# EAGLE design ac_switch (EAGLE 6.5.0)
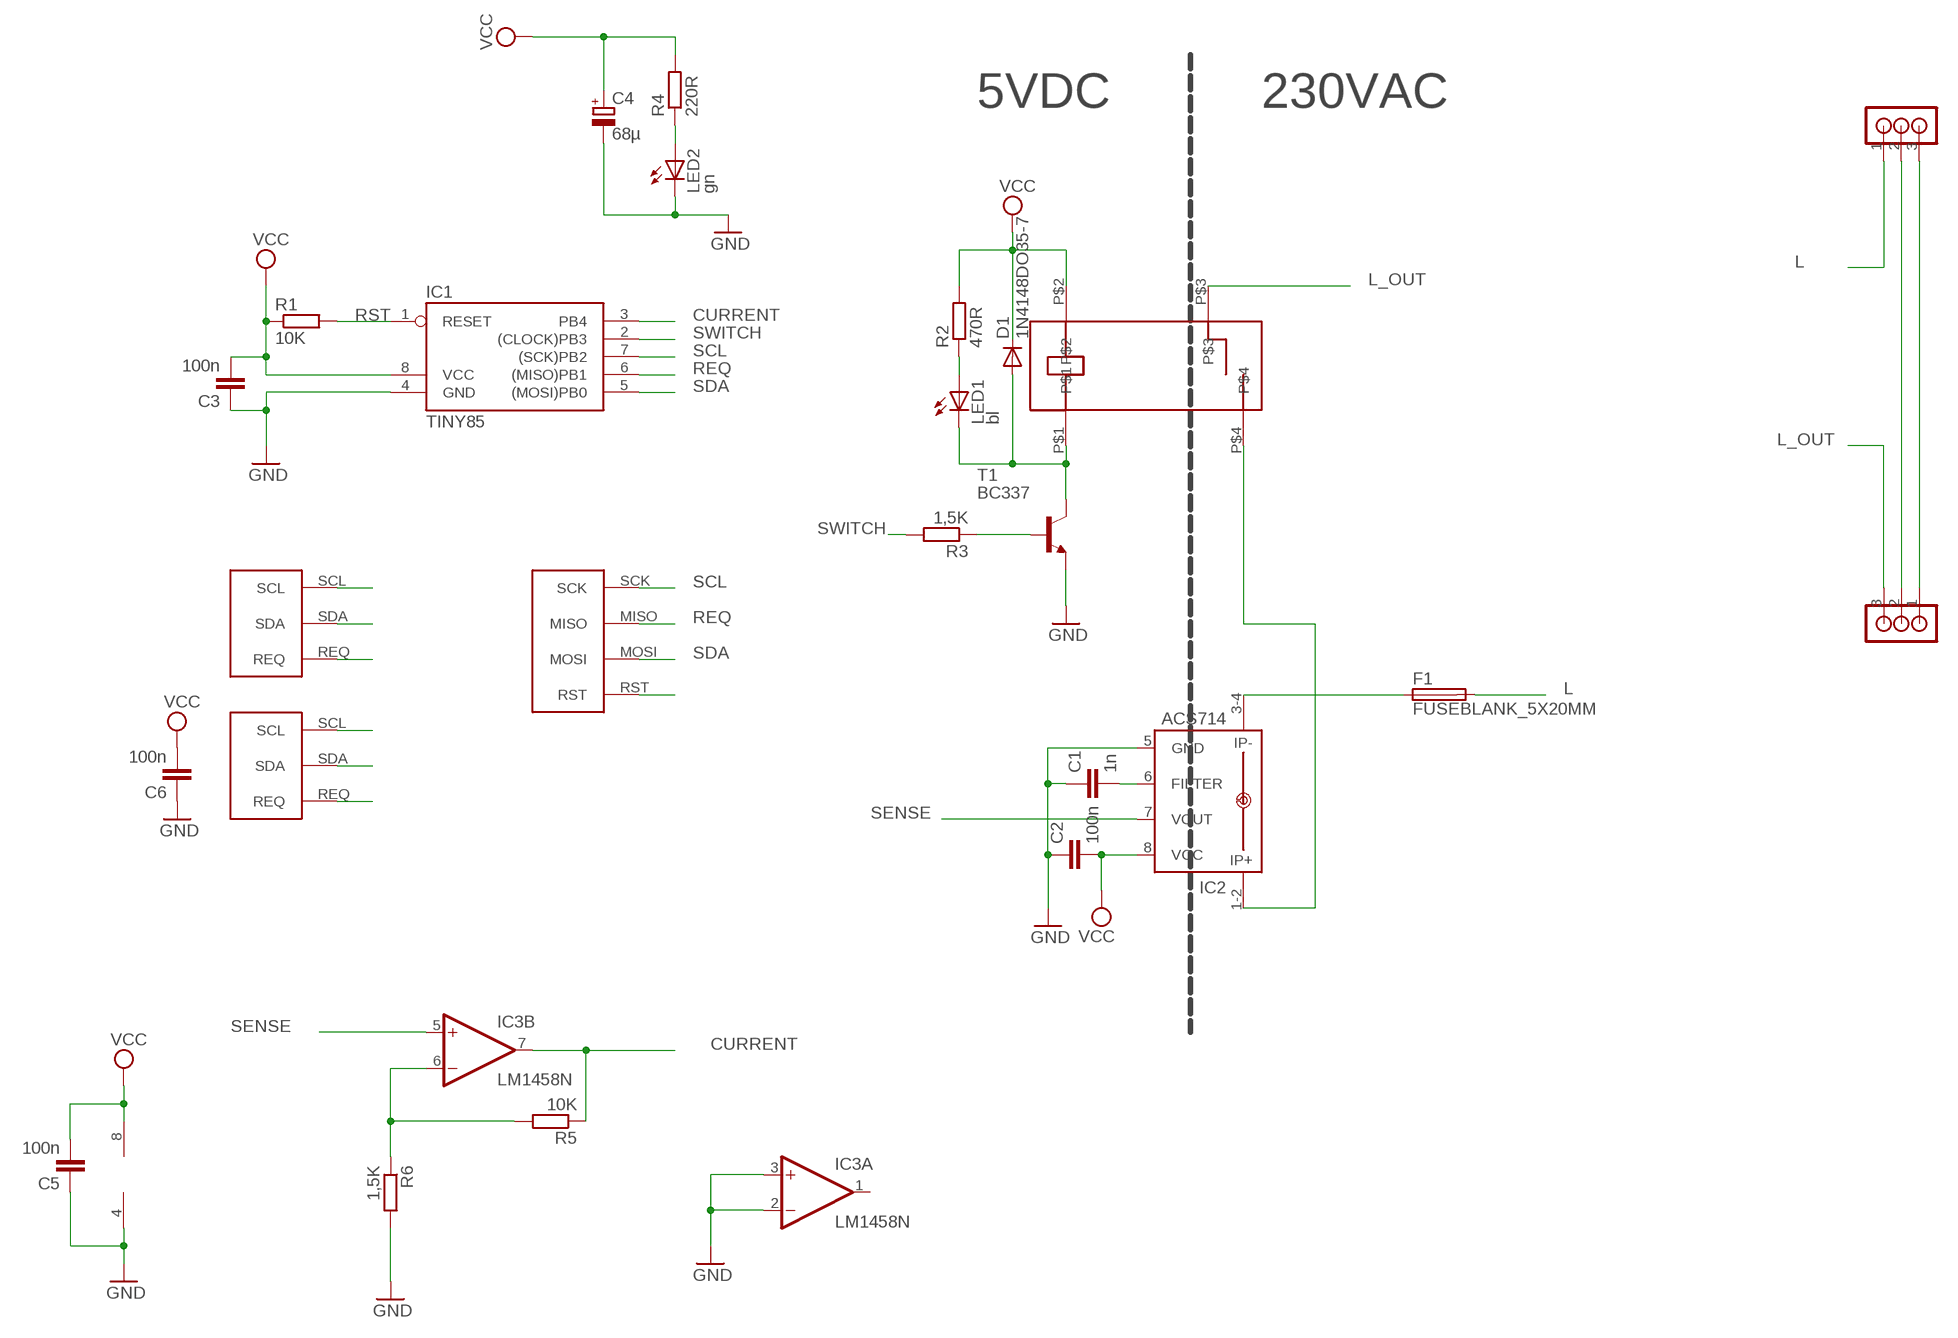
[diagram p0: schematic, sheet 1]

## Parts
C1  1n  C-EU025-024X044  [C025-024X044]
C2  100n  C-EU025-024X044  [C025-024X044]
C3  100n  C-EU025-024X044  [C025-024X044]
C4  68µ  CPOL-EUE3.5-8  [E3,5-8]
C5  100n  C-EU025-024X044  [C025-024X044]
C6  100n  C-EU025-024X044  [C025-024X044]
D1  1N4148DO35-7  [DO35-7]
F1  FUSEBLANK_5X20MM  [FUSE_HOLDER_5X20MM]
IC1  TINY85  TINY22P  [DIL08]
IC2  ACS714  [ACS714]
IC3  LM1458N  [DIL08]
LED1  bl  LED3MM  [LED3MM]
LED2  gn  LED3MM  [LED3MM]
R1  10K  R-EU_0207/12  [0207/12]
R2  470R  R-EU_0207/10  [0207/10]
R3  1,5K  R-EU_0207/10  [0207/10]
R4  220R  R-EU_0207/10  [0207/10]
R5  10K  R-EU_0207/10  [0207/10]
R6  1,5K  R-EU_0207/10  [0207/10]
T1  BC337  [TO92]
U$1  JS_05_MN_KT  [JS_05_MN_KT]
U$2  RIACON_101_3  [RIACON_101_3]
U$3  I3C_PORT  [I3C_PADS]
U$4  AVR_ISP  [AVR_ISP]
U$5  I3C_PORT  [I3C_PADS]
U$6  RIACON_101_3  [RIACON_101_3]

## Nets
CURRENT: IC1.3(PB4) IC3.7(B:OUT) R5.1
GND: C1.1 C2.1 C3.1 C4.- C5.1 C6.1 IC1.4(GND) IC2.5(GND) IC3.2(A:-IN) IC3.3(A:+IN) IC3.4(P:V-) LED2.K(C) R6.2 T1.1(E)
L: F1.2 U$2.1
L_OUT: U$1.P$3 U$6.3
N$1: D1.A LED1.K(C) T1.3(C) U$1.P$1
N$2: C1.2 IC2.6(FILTER)
N$3: IC2.1-2(IP+) U$1.P$4
N$4: LED1.A R2.1
N$5: R3.1 T1.2(B)
N$6: LED2.A R4.1
N$7: F1.1 IC2.3-4(IP-)
N$8: U$2.3 U$6.1
N$9: U$2.2 U$6.2
N$10: IC3.6(B:-IN) R5.2 R6.1
REQ: IC1.6((MISO)PB1) U$3.REQ U$4.MISO U$5.REQ
RST: IC1.1(RESET) R1.2 U$4.RST
SCL: IC1.7((SCK)PB2) U$3.SCL U$4.SCK U$5.SCL
SDA: IC1.5((MOSI)PB0) U$3.SDA U$4.MOSI U$5.SDA
SENSE: IC2.7(VOUT) IC3.5(B:+IN)
SWITCH: IC1.2((CLOCK)PB3) R3.2
VCC: C2.2 C3.2 C4.+ C5.2 C6.2 D1.C IC1.8(VCC) IC2.8(VCC) IC3.8(P:V+) R1.1 R2.2 R4.2 U$1.P$2
Unconnected: IC3.1(A:OUT)

## Notes on the sheet
- 5VDC | 230VAC

## Power pins joined to a net without a drawn wire
GND: U$3.GND U$4.GND U$5.GND
VCC: U$3.VCC U$4.VCC U$5.VCC

## Library data of the parts
C1-C3 C5 C6 = resistor:C-EU: CAPACITOR, European symbol
C4 = resistor:CPOL-EU: POLARIZED CAPACITOR, European symbol
D1 = diode:1N4148: DIODE high speed (Philips)
F1 = fuse:FUSE: Fuse; OC_FARNELL: unknown; OC_NEWARK: unknown
IC1 = atmel:TINY22: MICROCONTROLLER 1K ROM 128 bytes RAM 128 bytes EEPROM; OC_FARNELL: unknown; OC_NEWARK: unknown
IC2 = n39:ACS714: ACS714 Automotive Grade, Fully Integrated, Hall Effect-Based Linear Current Sensor IC with 2.1 kVRMS Voltage Isolation and a Low-Resistance Current Conductor Autor: Tux
IC3 = linear:*1458: OP AMP
LED1 LED2 = led:LED: LED OSRAM: - CHIPLED LG R971, LG N971, LY N971, LG Q971, LY Q971, LO R971, LY R971 LH N974, LH R974 LS Q976, LO Q976, LY Q976 LO Q996 - Hyper CHIPLED LW Q18S LB Q993, LB Q99A, LB R99A - SideLED LS A670, LO A670, LY A670, LG A670, LP A670 LB A673, LV A673, LT A673, LW A673 LH A674 LY A675 LS A676, LA A676, LO A676, LY A676, LW A676 LS A679, LY A679, LG A679 - Hyper Micro SIDELED® LS Y876, LA Y876, LO Y876, LY Y876 LT Y87S - SmartLED LW L88C, LW L88S LB L89C, LB L89S, LG L890 LS L89K, LO L89K, LY L89K LS L896, LA L896, LO L896, LY L896 - TOPLED LS T670, LO T670, LY T670, LG T670, LP T670 LSG T670, LSP T670, LSY T670, LOP T670, LYG T670 LG T671, LOG T671, LSG T671 LB T673, LV T673, LT T673, LW T673 LH T674 LS T676, LA T676, LO T676, LY T676, LB T676, LH T676, LSB T676, LW T676 LB T67C, LV T67C, LT T67C, LS T67K, LO T67K, LY T67K, LW E67C LS E67B, LA E67B, LO E67B, LY E67B, LB E67C, LV E67C, LT E67C LW T67C LS T679, LY T679, LG T679 LS T770, LO T770, LY T770, LG T770, LP T770 LB T773, LV T773, LT T773, LW T773 LH T774 LS E675, LA E675, LY E675, LS T675 LS T776, LA T776, LO T776, LY T776, LB T776 LHGB T686 LT T68C, LB T68C - Hyper Mini TOPLED® LB M676 - Mini TOPLED Santana® LG M470 LS M47K, LO M47K, LY M47K Source: http://www.osram.convergy.de LUXEON: - LUMILED® LXK2-PW12-R00, LXK2-PW12-S00, LXK2-PW14-U00, LXK2-PW14-V00 LXK2-PM12-R00, LXK2-PM12-S00, LXK2-PM14-U00 LXK2-PE12-Q00, LXK2-PE12-R00, LXK2-PE12-S00, LXK2-PE14-T00, LXK2-PE14-U00 LXK2-PB12-K00, LXK2-PB12-L00, LXK2-PB12-M00, LXK2-PB14-N00, LXK2-PB14-P00, LXK2-PB14-Q00 LXK2-PR12-L00, LXK2-PR12-M00, LXK2-PR14-Q00, LXK2-PR14-R00 LXK2-PD12-Q00, LXK2-PD12-R00, LXK2-PD12-S00 LXK2-PH12-R00, LXK2-PH12-S00 LXK2-PL12-P00, LXK2-PL12-Q00, LXK2-PL12-R00 Source: www.luxeon.com KINGBRIGHT: KA-3528ASYC Source: www.kingbright.com
R1-R6 = resistor:R-EU_: RESISTOR, European symbol
T1 = transistor:BC337: NPN TRANSISTOR
U$1 = n39:JS_05_MN_KT
U$2 U$6 = n39:RIACON_101_3: RIACON Anschlussklemme (AKL) Typ 101 Rastermaß 5,08 mm; REICHELT: AKL 101-3
U$3 U$5 = n39:I3C_PORT: I³C Port I³C is I²C with an additional request line, which a client can pull down to signal relevant state changes and trigger the master to poll data, and GND+VCC lines. Author: Tux
U$4 = n39:AVR_ISP: AVR ISP Pinheader Belegung: 1: MISO 2: VCC 3: SCK 4: MOSI 5: Reset 6: GND

## Board
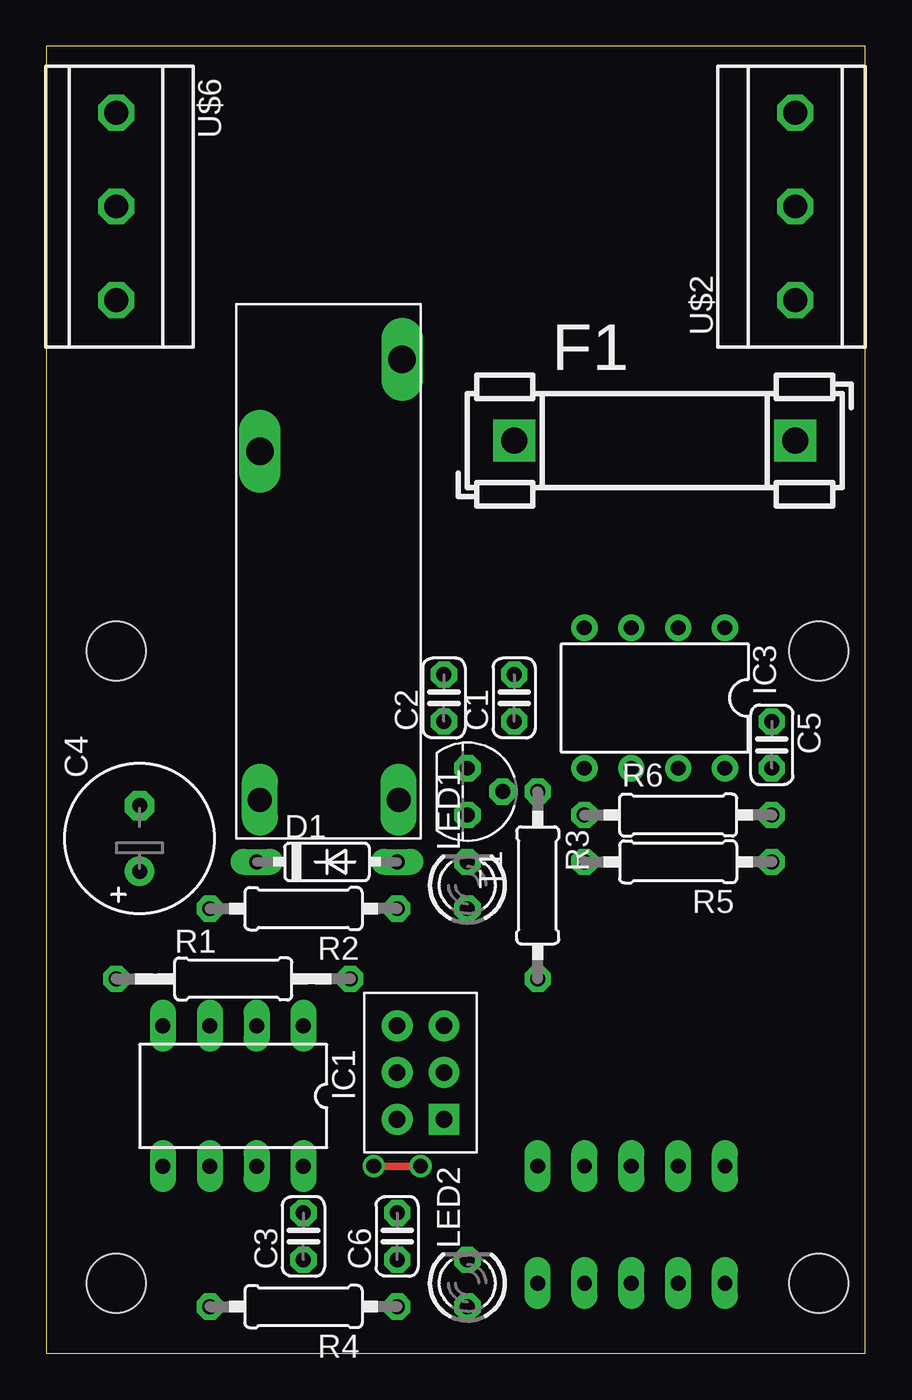
[diagram p1: board, top side]
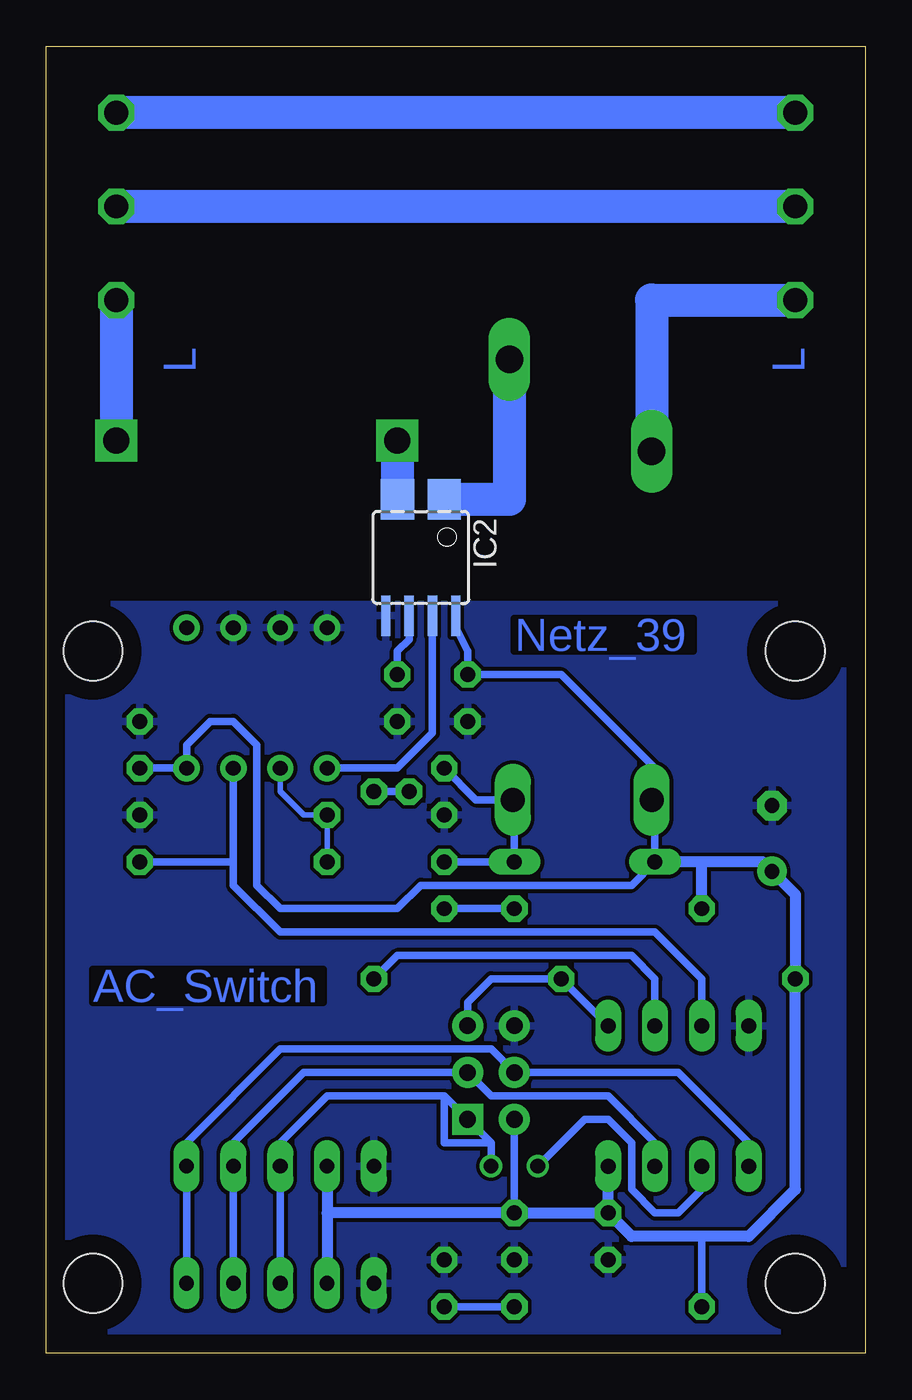
[diagram p2: board, bottom side, seen from below]

Size 44.44 x 70.93 mm. Coordinates in mm from the lower left corner, seen from the top.
Outline: 44.44,0 44.44,70.93 0,70.93 0,0 44.44,0
Copper layers (1*16): Top 0.035mm / dielectric 1.5mm / Bottom 0.035mm
Design rules "default *": minimum track width 12mil, minimum drill 24mil, track to track 8mil, track to pad 8mil, pad to pad 8mil, via to via 8mil, smd to smd 8mil, copper to edge 40mil, drill to drill 8mil, minimum pad ring 12mil, minimum via ring 8mil, stop-mask expansion 4mil, vias tented up to drill 0mil, thermal gap 10mil
Holes 3.2 mm at 3.8,38.1 3.8,3.81 41.9,3.81 41.9,38.1

### Footprints (pad centres in the part's own frame; a part is rotated, then mirrored left to right if it is on the bottom)
C025-024X044 = drill 0.813 octagon: 1 -1.27,0; 2 1.27,0
E3,5-8 = drill 0.813 pad 1.6: + -1.778,0 | drill 0.813 pad 1.6 octagon: - 1.778,0
DO35-7 = drill 0.813 long: A 3.81,0; C -3.81,0
FUSE_HOLDER_5X20MM = drill 1.422 pad 2.286 square: 1 0,0; 2 15.24,0
DIL08 = drill 0.813 long: 1 -3.81,-3.81; 2 -1.27,-3.81; 3 1.27,-3.81; 4 3.81,-3.81; 5 3.81,3.81; 6 1.27,3.81; 7 -1.27,3.81; 8 -3.81,3.81
ACS714 = smd 1.8 x 2.2: 1-2 -1.27,-3.154; 3-4 1.26,-3.154 | smd 0.5 x 2.2: 5 1.905,3.154; 6 0.635,3.154; 7 -0.635,3.154; 8 -1.905,3.154
DIL08' = drill 0.813 pad 1.27: 1 -3.81,-3.81; 2 -1.27,-3.81; 3 1.27,-3.81; 4 3.81,-3.81; 5 3.81,3.81; 6 1.27,3.81; 7 -1.27,3.81; 8 -3.81,3.81
LED3MM = drill 0.813 octagon: A -1.27,0; K 1.27,0
0207/12 = drill 0.813 octagon: 1 -6.35,0; 2 6.35,0
0207/10 = drill 0.813 octagon: 1 -5.08,0; 2 5.08,0
TO92 = drill 0.813 octagon: 1 1.27,0; 2 0,1.905; 3 -1.27,0
JS_05_MN_KT = drill 1.3 long: P$1 2.1,1.19; P$2 2.1,8.71 | drill 1.5 long: P$3 21,8.71; P$4 26,1
RIACON_101_3 = drill 1.3 octagon: 1 -5.08,0; 2 0,0; 3 5.08,0
I3C_PADS = drill 0.8 long: GND 0,5.08; REQ 0,0; SCL 0,-2.54; SDA 0,-5.08; VCC 0,2.54
AVR_ISP = drill 0.9 pad 1.676: GND 1.27,-2.54; MOSI 1.27,0; RST -1.27,-2.54; SCK -1.27,0; VCC 1.27,2.54 | drill 0.9 pad 1.676 square: MISO -1.27,2.54

### Placement (x,y rotation side)
C1  25.39,35.56 90 top
C2  21.58,35.56 90 top
C3  13.96,6.35 90 top
C4  5.07,27.94 90 top
C5  39.36,33.02 270 top
C6  19.04,6.35 90 top
D1  15.23,26.67 0 top
F1  25.39,49.53 0 top
IC1  10.15,13.97 180 top
IC2  24.12,43.18 180 bottom
IC3  LM1458N  [DIL08']  33.01,35.56 180 top
LED1  22.85,25.4 90 top
LED2  22.85,3.81 90 top
R1  10.15,20.32 0 top
R2  13.96,24.13 180 top
R3  26.66,25.4 270 top
R4  13.96,2.54 180 top
R5  34.28,26.67 180 top
R6  34.28,29.21 0 top
T1  22.85,30.48 270 top
U$1  20.31,27.94 90 top
U$2  40.63,62.23 90 top
U$3  31.74,3.81 90 top
U$4  20.31,15.24 180 top
U$5  31.74,10.16 90 top
U$6  3.8,62.23 270 top

### Tracks (layer width: path | path; a pad name or v marks a point on that pad's centre or on a via)
CURRENT
  Bottom 0.406: IC1.3 8.88,20.32 11.42,22.86 31.74,22.86 34.28,25.4 34.28,26.67 | IC3.7 34.28,26.67 | R5.1 34.28,26.67
GND
  pour Bottom: -0.01,0 44.44,0 44.44,40.64 -0.01,40.64
L
  Bottom 1.778: U$2.1 F1.2
L_OUT
  Bottom 1.778: U$6.3 11.6,57.15 U$1.P$3
N$1
  Bottom 0.406: T1.3 21.14,30.04 U$1.P$1 19.04,29.96 D1.A LED1.K
N$2
  Bottom 0.406: C1.2 25.39,38.1 24.75,38.73 IC2.6
N$3
  Bottom 1.778: U$1.P$4 19.31,46.33 IC2.1-2
N$4
  Bottom 0.406: LED1.A R2.1
N$5
  Bottom 0.406: R3.1 T1.2
N$6
  Bottom 0.406: LED2.A R4.1
N$7
  Bottom 1.778: F1.1 IC2.3-4
N$8
  Bottom 1.778: U$6.1 U$2.3
N$9
  Bottom 1.778: U$6.2 U$2.2
N$10
  Bottom 0.305: IC3.6 31.74,30.48 30.47,29.21 R6.1 R5.2
REQ  (via drill 0.8)
  Top 0.406: v20.31,10.16 v17.77,10.16
  Bottom 0.406: 22.85,13.97 29.2,13.97 31.74,11.43 U$5.REQ U$3.REQ | 22.85,13.97 U$4.MISO 20.31,11.43 | IC1.6 8.88,8.89 10.15,7.62 11.42,7.62 12.69,8.89 12.69,11.43 13.96,12.7 15.23,12.7 v17.77,10.16 | 20.31,11.43 v20.31,10.16 | 22.85,13.97 22.85,11.43 20.31,11.43
RST
  Bottom 0.406: IC1.1 R1.2 20.31,20.32 21.58,19.05 U$4.RST
SCL
  Bottom 0.406: IC1.7 11.42,11.43 13.96,13.97 20.31,13.97 U$4.SCK 30.47,15.24 34.28,11.43 U$5.SCL U$3.SCL
SDA
  Bottom 0.406: IC1.5 6.34,11.43 10.15,15.24 U$4.MOSI 20.31,16.51 31.74,16.51 36.82,11.43 U$5.SDA U$3.SDA
SENSE
  Bottom 0.406: IC2.7 23.48,33.66 25.39,31.75 IC3.5
SWITCH
  Bottom 0.406: IC1.2 11.42,20.32 12.69,21.59 25.39,21.59 R3.2
VCC
  Bottom 0.406: IC2.8 22.21,39.37 21.58,38.1 C2.2 16.5,36.83 11.42,31.75 11.42,30.22 U$1.P$2 11.42,29.86 D1.C 12.69,25.4 24.12,25.4 25.39,24.13 31.74,24.13 33.01,25.4 33.01,33.02 34.28,34.29 35.55,34.29 36.82,33.02 IC3.8 C5.2 | U$4.VCC C6.2 | R4.2 8.88,6.35
  Bottom 0.61: C3.2 C6.2 29.2,7.62 | C3.2 IC1.8 | 8.88,26.67 5.58,26.67 C4.+ 3.8,24.89 R1.1 3.8,8.89 6.34,6.35 8.88,6.35 12.69,6.35 C3.2 | 8.88,26.67 D1.C | U$5.VCC 29.2,7.62 | 29.2,7.62 U$3.VCC | R2.2 8.88,26.67

### Text on the board
Bottom: L | L | Netz_39 | AC_Switch